# EAGLE design ColonRelay (EAGLE 9.5.2)
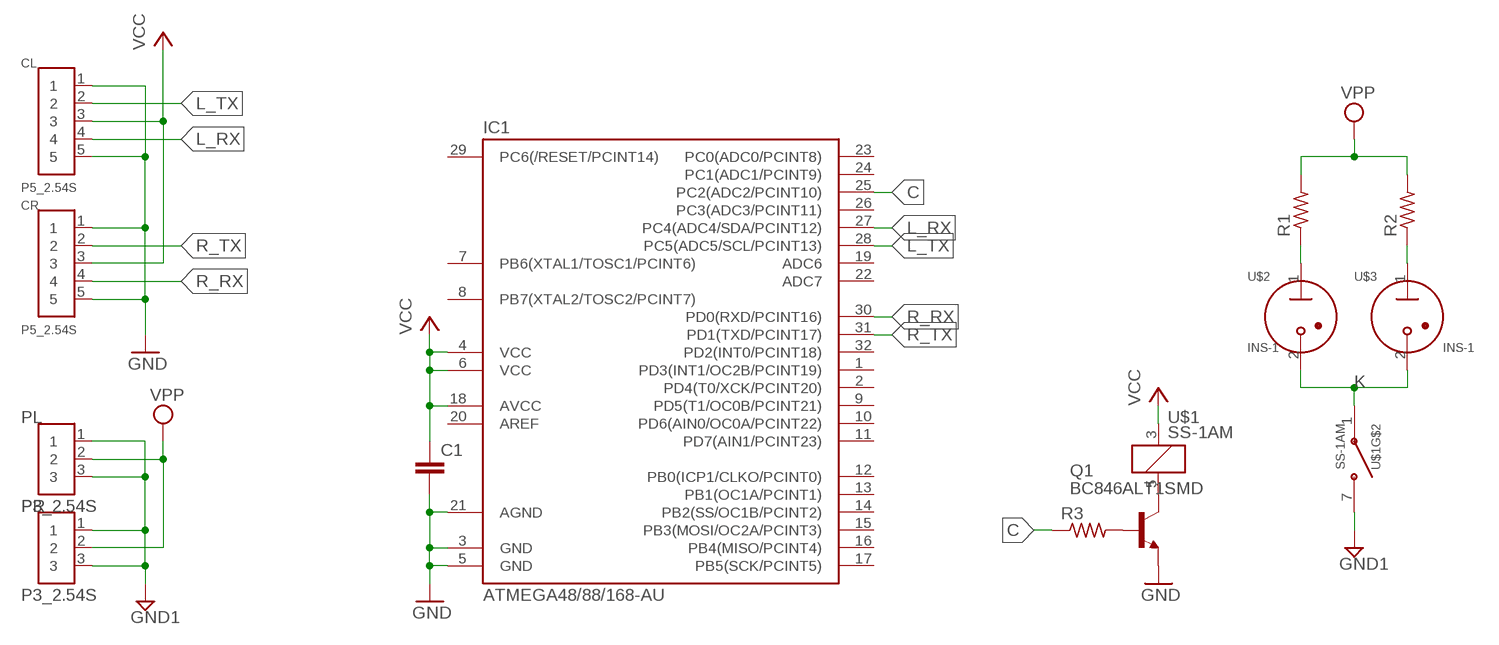
[diagram p0: schematic, sheet 1]

## Parts
C1  C-EUC0603K  [C0603K]
CL  P5_2.54S  [P5_2.54S]
CR  P5_2.54S  [P5_2.54S]
IC1  ATMEGA48/88/168-AU  [TQFP32-08]
PL  P3_2.54S  [P3_2.54S]
PR  P3_2.54S  [P3_2.54S]
Q1  BC846ALT1SMD  [SOT23]
R1  R-US_R1206  [R1206]
R2  R-US_R1206  [R1206]
R3  R-US_R0603  [R0603]
U$1  SS-1AM  [SS-1****M]
U$2  INS-1  [INS-1]
U$3  INS-1  [INS-1]

## Nets
C: IC1.25(PC2(ADC2/PCINT10)) R3.1
GND: C1.2 CL.1 CL.5 CR.1 CR.5 IC1.3(GND) IC1.5(GND) IC1.21(AGND) Q1.2(E)
GND1: PL.1 PL.3 PR.1 PR.3 U$1.7
K: U$1.1 U$2.2(C) U$3.2(C)
L_RX: CL.4 IC1.27(PC4(ADC4/SDA/PCINT12))
L_TX: CL.2 IC1.28(PC5(ADC5/SCL/PCINT13))
N$1: Q1.3(C) U$1.5
N$2: R2.1 U$3.1(A)
N$3: R1.1 U$2.1(A)
N$4: Q1.1(B) R3.2
R_RX: CR.4 IC1.30(PD0(RXD/PCINT16))
R_TX: CR.2 IC1.31(PD1(TXD/PCINT17))
VCC: C1.1 CL.3 CR.3 IC1.4(VCC) IC1.6(VCC) IC1.18(AVCC) U$1.3
VPP: PL.2 PR.2 R1.2 R2.2
Unconnected: IC1.1(PD3(INT1/OC2B/PCINT19)) IC1.2(PD4(T0/XCK/PCINT20)) IC1.7(PB6(XTAL1/TOSC1/PCINT6)) IC1.8(PB7(XTAL2/TOSC2/PCINT7)) IC1.9(PD5(T1/OC0B/PCINT21)) IC1.10(PD6(AIN0/OC0A/PCINT22)) IC1.11(PD7(AIN1/PCINT23)) IC1.12(PB0(ICP1/CLKO/PCINT0)) IC1.13(PB1(OC1A/PCINT1)) IC1.14(PB2(SS/OC1B/PCINT2)) IC1.15(PB3(MOSI/OC2A/PCINT3)) IC1.16(PB4(MISO/PCINT4)) IC1.17(PB5(SCK/PCINT5)) IC1.19(ADC6) IC1.20(AREF) IC1.22(ADC7) IC1.23(PC0(ADC0/PCINT8)) IC1.24(PC1(ADC1/PCINT9)) IC1.26(PC3(ADC3/PCINT11)) IC1.29(PC6(/RESET/PCINT14)) IC1.32(PD2(INT0/PCINT18))

## Library data of the parts
C1 = rcl:C-EU: CAPACITOR, European symbol; SPICEPREFIX: C
CL CR = pins:P5_2.54S
IC1 = atmega8:ATMEGA48/88/168
PL PR = pins:P3_2.54S
Q1 = transistor-npn:BC846*: NPN Transistor
R1-R3 = rcl:R-US_: RESISTOR, American symbol; SPICEPREFIX: R
U$1 = relays:SS-1A**M
U$2 U$3 = nixie-tube:INS-1

## Board
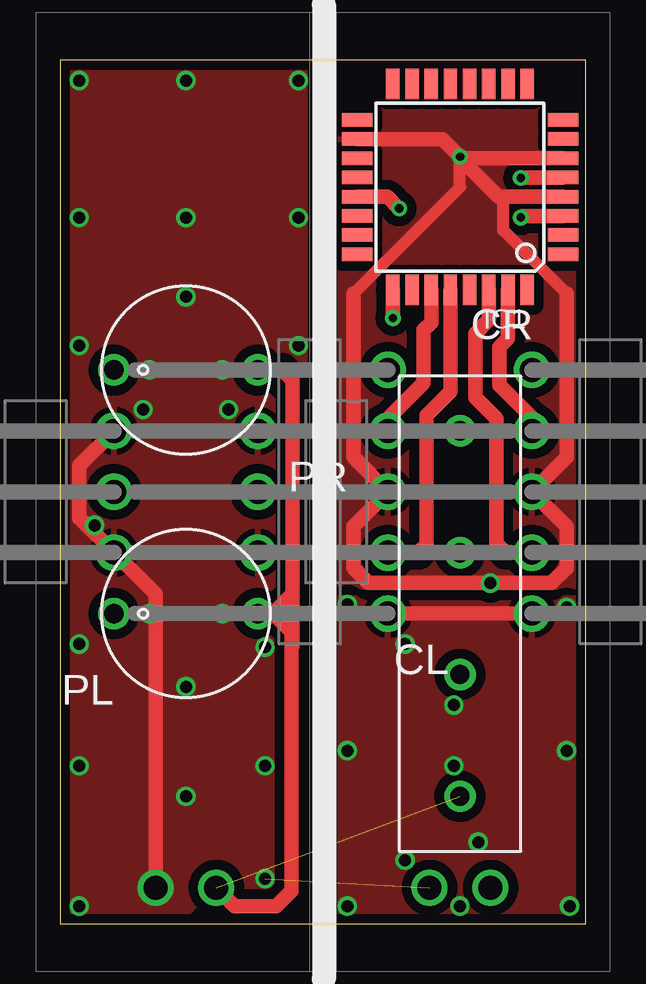
[diagram p1: board, top side]
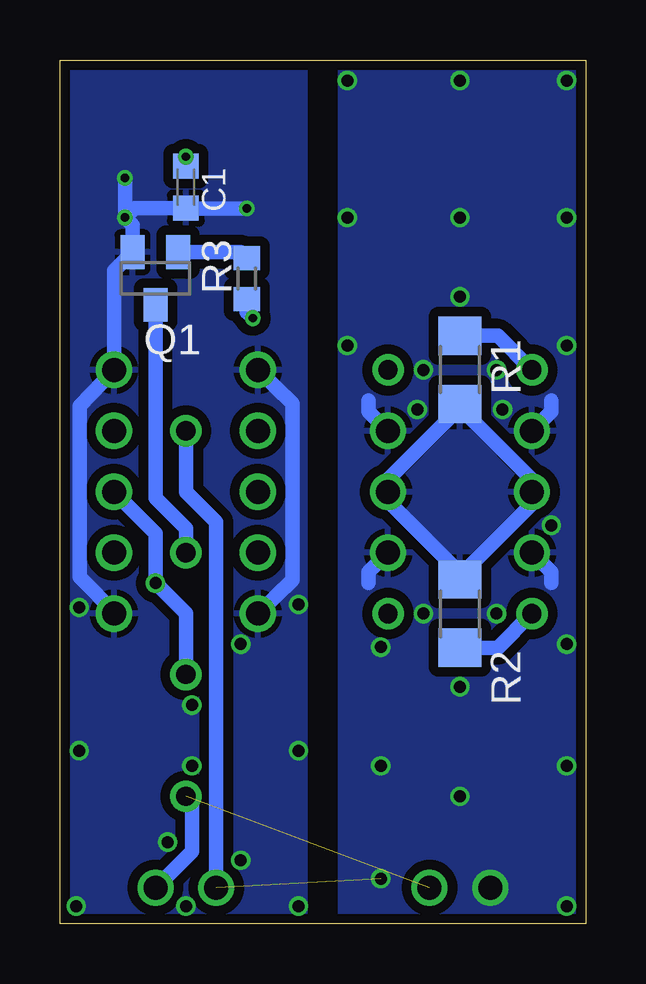
[diagram p2: board, bottom side, seen from below]

Size 21.93 x 36 mm. Coordinates in mm from the lower left corner, seen from the top.
Outline: 0,0 21.93,0 21.93,36 0,36 0,0
Copper layers (1*16): Top 0.035mm / dielectric 1.5mm / Bottom 0.035mm
Design rules "SeeedStudio_2layer_DRU_no_angle_20140221": minimum track width 6mil, minimum drill 12mil, track to track 6mil, track to pad 6mil, pad to pad 6mil, via to via 6mil, smd to smd 0mil, copper to edge 10mil, drill to drill 10mil, minimum pad ring 10mil, minimum via ring 6mil, stop-mask expansion 2mil, vias tented up to drill 100mil, thermal gap 10mil

### Footprints (pad centres in the part's own frame; a part is rotated, then mirrored left to right if it is on the bottom)
C0603K = smd 1.05 x 1.08: 1 -0.875,0; 2 0.875,0
P5_2.54S = drill 1: 1 0,5.08; 2 0,2.54; 3 0,0; 4 0,-2.54; 5 0,-5.08
TQFP32-08 = smd 1.27 x 0.559: 1 -4.293,2.8; 2 -4.293,2; 3 -4.293,1.2; 4 -4.293,0.4; 5 -4.293,-0.4; 6 -4.293,-1.2; 7 -4.293,-2; 8 -4.293,-2.8; 17 4.293,-2.8; 18 4.293,-2; 19 4.293,-1.2; 20 4.293,-0.4; 21 4.293,0.4; 22 4.293,1.2; 23 4.293,2; 24 4.293,2.8 | smd 0.559 x 1.27: 9 -2.8,-4.293; 10 -2,-4.293; 11 -1.2,-4.293; 12 -0.4,-4.293; 13 0.4,-4.293; 14 1.2,-4.293; 15 2,-4.293; 16 2.8,-4.293; 25 2.8,4.293; 26 2,4.293; 27 1.2,4.293; 28 0.4,4.293; 29 -0.4,4.293; 30 -1.2,4.293; 31 -2,4.293; 32 -2.8,4.293
P3_2.54S = drill 1: 1 0,2.54; 2 0,0; 3 0,-2.54
SOT23 = smd 1 x 1.4: 1 -0.95,-1.1; 2 0.95,-1.1; 3 0,1.1
R1206 = smd 1.6 x 1.803: 1 -1.422,0; 2 1.422,0
R0603 = smd 1 x 1.1: 1 -0.85,0; 2 0.85,0
SS-1****M = drill 0.8: 1 -7.62,0; 3 -2.54,0; 5 2.54,0; 7 7.62,0
INS-1 = drill 0.8: 1 0,3; 2 0,-3

### Placement (x,y rotation side)
C1  16.68,30.7 270 bottom
CL  13.68,18 180 top
CR  19.68,18 0 top
IC1  16.68,30.7 180 top
PL  2.25,18 180 top
PR  8.25,18 0 top
Q1  17.95,26.89 180 bottom
R1  5.25,23.08 270 bottom
R2  5.25,12.92 90 bottom
R3  14.14,26.89 90 bottom
U$1  SS-1A*M  [SS-1****M]  16.68,12.92 90 top
U$2  5.25,23.08 90 top
U$3  5.25,12.92 90 top

### Tracks (layer width: path | path; a pad name or v marks a point on that pad's centre or on a via)
C  (via drill 0.35)
  Top 0.61: IC1.25 v13.88,25.25 v13.89,25.24
  Bottom 0.61: R3.1 14.14,25.49 v13.89,25.24
GND  (via drill 0.35, 0.5)
  Top 0.61: IC1.5 19.23,31.1 v19.22,31.09 | v19.22,29.43 19.29,29.5 IC1.3 | IC1.21 13.65,30.3 v14.14,29.81 | CL.1 CR.5
  Bottom 0.61: CR.5 19.6,12.93 21.12,14.44 21.12,21.56 CR.1 19.68,27.21 Q1.2 18.9,29.11 v19.22,29.43 | CL.1 12.23,14.32 12.23,21.68 CL.5 | v19.22,31.09 v19.22,29.43 | v14.14,29.81 16.67,29.81 C1.2 18.82,29.82 v19.22,29.43
  other vias: 21.25,0.73 11.98,0.73 16.68,0.73 21.12,13.17 16.43,9.11 16.43,6.57 17.44,3.39 14.39,11.65 11.98,7.21 21.12,7.21 11.98,13.3 14.39,2.63
  pour Top (isolate 0.406): 11.6,13.68 21.76,13.68 21.76,0.22 11.6,0.22
  pour Bottom (isolate 0.406): 11.6,0.22 21.76,0.22 21.76,35.78 11.6,35.78
GND1  (via drill 0.5, 1)  (1 unrouted)
  Top 0.61: PL.1 PR.3 | PR.1 PL.3 0.8,19.09 0.8,16.91 PL.1 | v3.98,1.49 3.98,13.73 PL.1
  Bottom 0.61: U$1.7 16.68,18 15.41,16.73 v15.41,1.49 | PL.3 1.44,21.35 1.44,21.81 | 9.06,21.81 9.06,21.35 PR.1 7.79,20.54 | PR.3 9.06,14.65 9.06,14.19 | PL.1 1.44,14.65 1.44,14.19
  other vias: 5.25,29.43 0.8,6.57 0.8,0.73 5.25,5.3 8.55,6.57 8.55,1.87 8.55,11.52 6.77,12.92 3.73,12.92 5.25,9.87 0.8,11.65 1.44,16.6 3.47,21.43 3.73,23.08 0.8,24.1 6.77,23.08 7.03,21.43 9.95,24.1 5.25,26.13 0.8,29.43 0.8,35.14 5.25,35.14 9.95,35.14 9.95,29.43
  pour Bottom (isolate 0.406): 0.17,35.78 10.33,35.78 10.33,18 9.06,18 5.25,21.81 1.44,18 0.17,18
  pour Bottom (isolate 0.406): 0.17,18 1.44,18 5.25,14.19 9.06,18 10.33,18 10.33,0.22 0.17,0.22
  pour Top (isolate 0.406): 5.25,0.22 0.17,0.22 0.17,35.78 10.33,35.78 10.33,23.08 7.79,23.08 9.06,21.81 9.06,0.86 5.88,0.86
K  (via drill 1)  (1 unrouted)
  Top 0.61: U$2.2 9.27,23.08 9.7,22.65 9.7,13.73 | 9.7,13.73 8.88,12.92 | v6.52,1.49 7.28,0.73 9.01,0.73 9.65,1.36 9.65,11.52 | 9.65,11.52 9.65,12.16 8.88,12.92 | U$3.2 8.88,12.92 | 9.7,13.73 9.7,11.57 9.65,11.52
  Bottom 0.61: U$1.1 16.43,5.05 16.43,3.01 v17.95,1.49
L_RX
  Top 0.61: IC1.27 15.48,25.05 15.16,24.73 15.16,22.52 13.68,21.05 CL.4
L_TX
  Top 0.61: CL.2 14.95,15.46 15.28,15.79 15.28,21.18 16.28,22.17 IC1.28
N$1
  Bottom 0.61: Q1.3 17.95,17.75 16.68,16.48 U$1.5
N$2
  Bottom 0.61: U$3.1 3.67,11.5 R2.1
N$3
  Bottom 0.61: U$2.1 3.67,24.5 R1.1
N$4
  Bottom 0.61: R3.2 14.39,27.99 Q1.1
R_RX
  Top 0.61: 19.61,15.46 CR.4 18.59,15.46 18.2,15.84 18.2,21.05 17.31,21.94 17.31,24.6 17.88,25.17 IC1.30
R_TX
  Top 0.61: IC1.31 18.68,24.38 18.33,24.03 18.33,22.45 19.68,21.1 CR.2
VCC  (via drill 0.35, 0.5)
  Top 0.508: 21.12,26.26 18.49,28.9 18.49,30.09 18.28,30.3 | 12.23,26.26 16.68,30.7 16.68,31.9
  Top 0.61: IC1.4 18.28,30.3 16.68,31.9 v16.68,31.97 | IC1.18 15.95,32.7 v16.68,31.97 | IC1.6 16.75,31.9 v16.68,31.97 | 21.12,26.26 21.12,19.45 CR.3 21.12,16.55 21.12,14.82 20.49,14.19 v17.95,14.19 12.87,14.19 12.23,14.82 12.23,16.55 CL.3 12.23,19.45 12.23,26.26
  Bottom 0.61: CR.3 17.95,16.27 v17.95,14.19 16.68,12.92 U$1.3 | C1.1 v16.68,31.97
  pour Top (isolate 0.406): 11.6,13.94 21.76,13.94 21.76,34 11.6,34
VPP
  Bottom 0.61: 5.25,21.51 2.25,18.51 PL.2 2.25,17.49 5.25,14.49 | 5.25,21.51 8.25,18.51 PR.2 8.25,17.62 5.25,14.62 5.25,14.49 | 5.25,21.51 R1.2 | 5.25,14.49 R2.2
  pour Bottom: 2.2,18 5.25,21.05 8.3,18 5.25,14.95